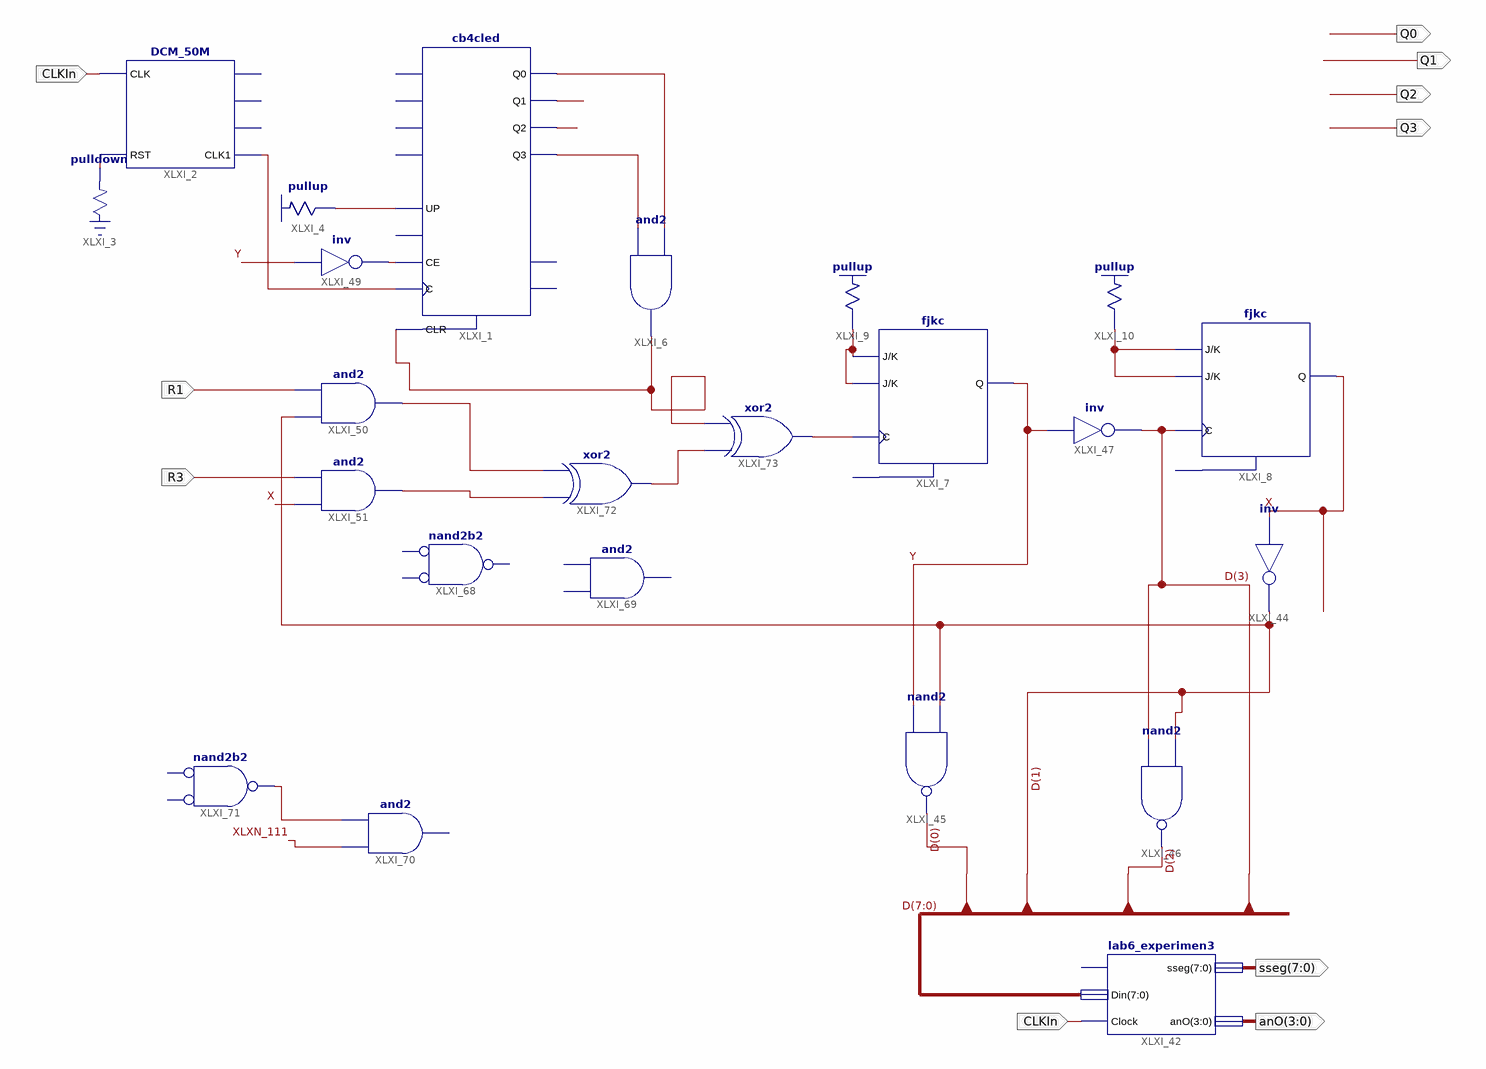
[diagram p0: schematic sheet 1]
// Xilinx ISE schematic lab9_experiment1.sch (spartan3e) as structural Verilog: 23 symbols, 9 ports
module lab9_experiment1 (
  input  CLKIn,
  input  R1,
  input  R3,
  output Q1,
  output Q2,
  output Q3,
  output [7:0] sseg,
  output [3:0] anO,
  output Q0
);

  wire X, XLXN_4, XLXN_5, XLXN_6, XLXN_17, XLXN_31, XLXN_33, XLXN_106, XLXN_111, XLXN_112, XLXN_115,
       XLXN_116, XLXN_117, XLXN_118, Y;
  wire [7:0] D;

  cb4cled XLXI_1 (
    .C(XLXN_6), .CE(XLXN_17), .CLR(XLXN_115), .UP(XLXN_5), .Q0(Q0), .Q1(Q1), .Q2(Q2), .Q3(Q3));  // open: D0, D1, D2, D3, L, CEO, TC
  DCM_50M XLXI_2 (.CLK(CLKIn), .RST(XLXN_4), .CLK1(XLXN_6));  // open: CLK1M, CLK10k, CLK1k
  \pulldown  XLXI_3 (.O(XLXN_4));
  \pullup  XLXI_4 (.O(XLXN_5));
  and XLXI_6 (XLXN_115, Q3, Q0);
  fjkc XLXI_7 (.C(XLXN_106), .J(XLXN_31), .K(XLXN_31), .Q(Y));  // open: CLR
  fjkc XLXI_8 (.C(D[3]), .J(XLXN_33), .K(XLXN_33), .Q(X));  // open: CLR
  \pullup  XLXI_9 (.O(XLXN_31));
  \pullup  XLXI_10 (.O(XLXN_33));
  lab6_experimen3 XLXI_42 (.Din(D), .Clock(CLKIn), .sseg(sseg), .anO(anO));  // open: En
  not XLXI_44 (D[1], X);
  nand XLXI_45 (D[0], Y, D[1]);
  nand XLXI_46 (D[2], D[3], D[1]);
  not XLXI_47 (D[3], Y);
  not XLXI_49 (XLXN_17, Y);
  and XLXI_50 (XLXN_116, D[1], R1);
  and XLXI_51 (XLXN_117, X, R3);
  // nand2b2 XLXI_68 is placed but not wired
  // and2 XLXI_69 is placed but not wired
  // and2 XLXI_70 has open pins: I0=XLXN_111, I1=XLXN_112, O=open
  // nand2b2 XLXI_71 has open pins: I0=open, I1=open, O=XLXN_112
  xor XLXI_72 (XLXN_118, XLXN_117, XLXN_116);
  xor XLXI_73 (XLXN_106, XLXN_118, XLXN_115);
endmodule
